# EAGLE design mouseHatbiggertest (EAGLE 9.6.2)
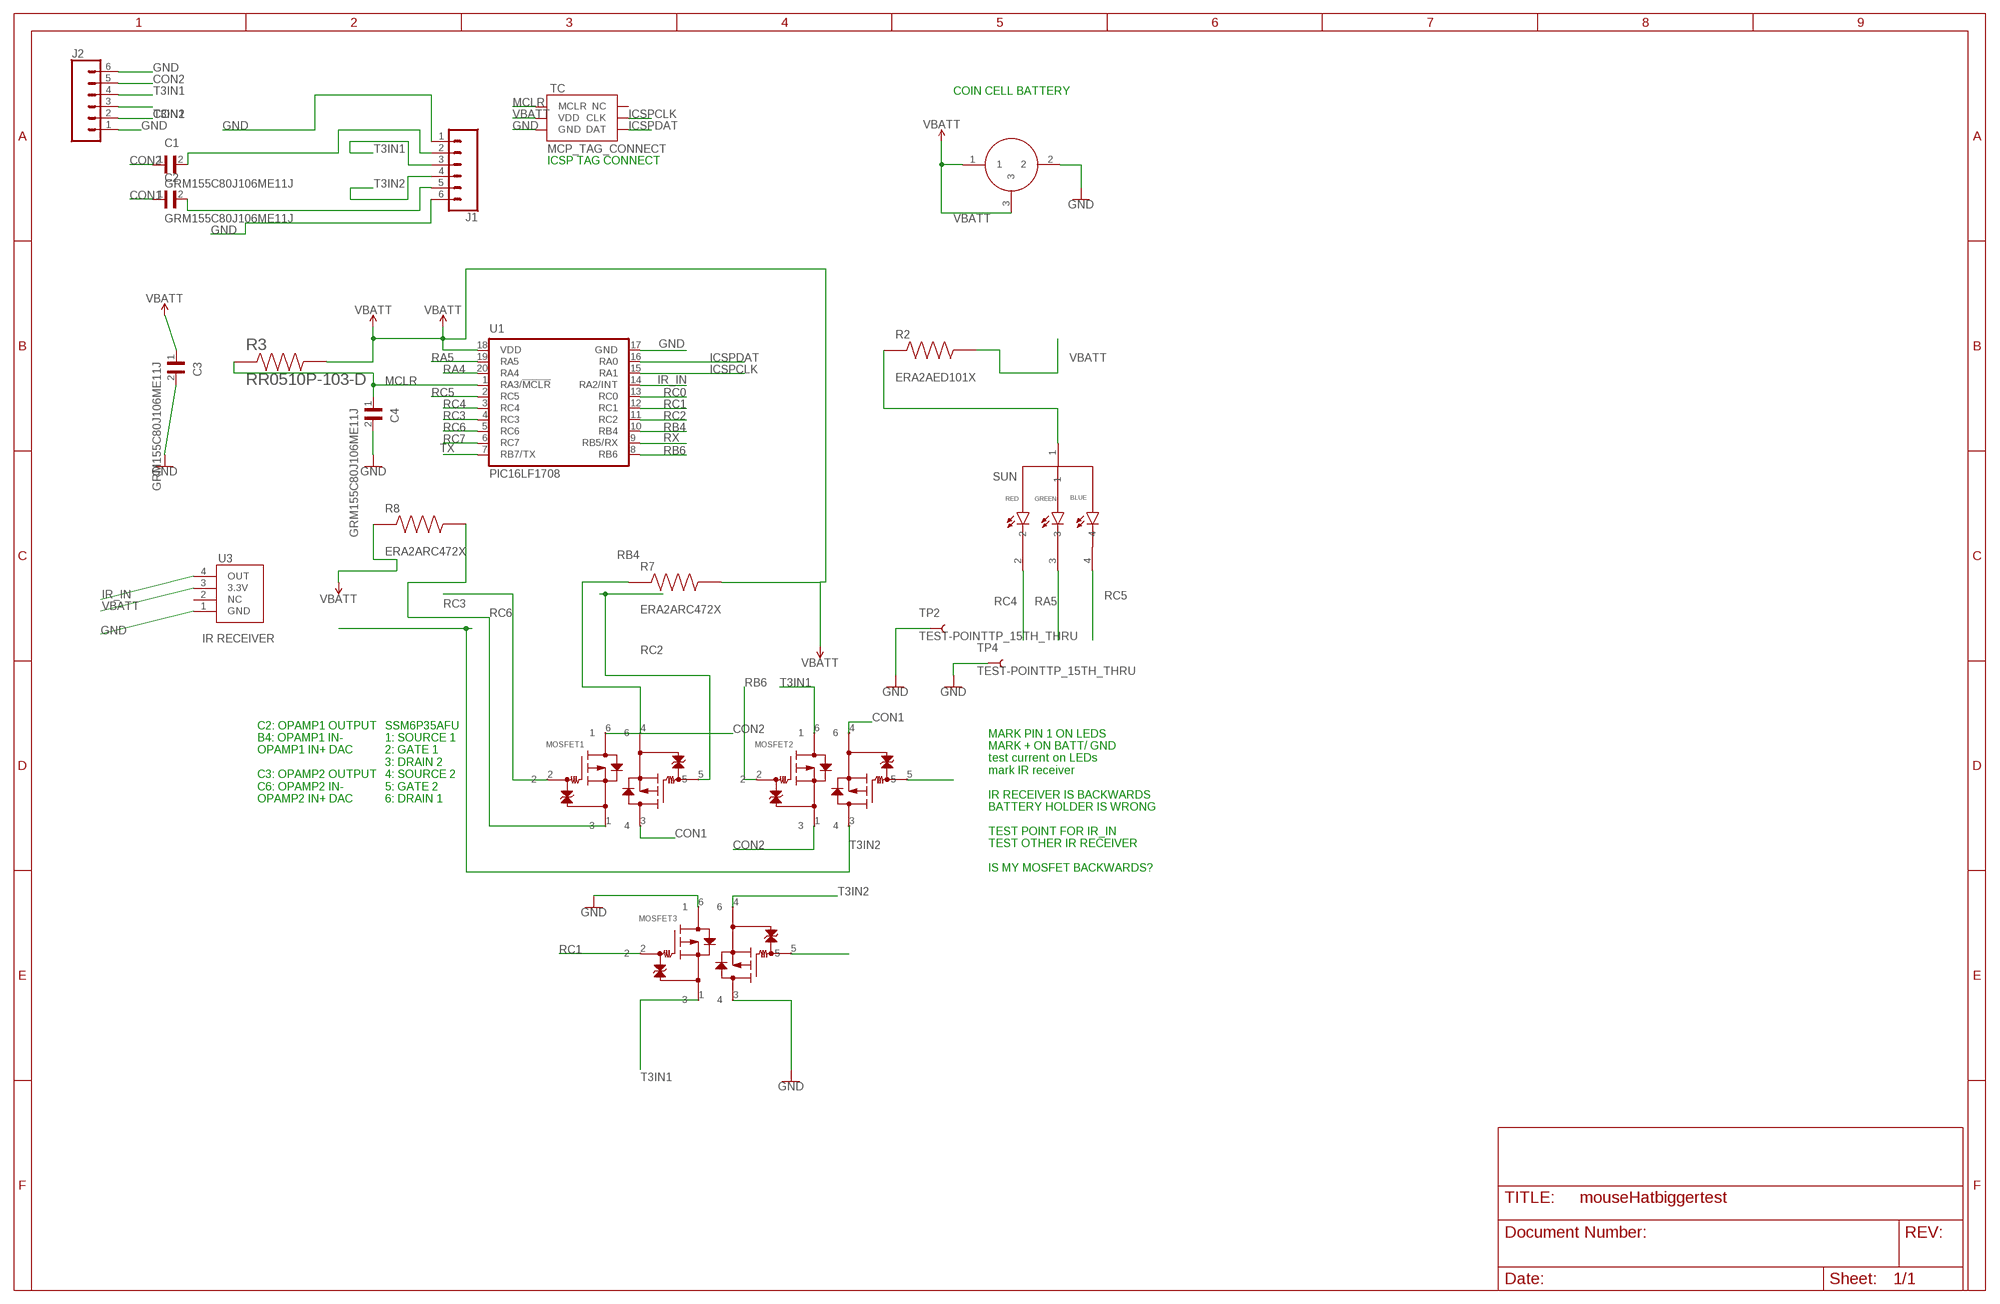
[diagram p0: schematic, sheet 1]

## Parts
C1  GRM155C80J106ME11J  [CAPC1005X70N]
C2  GRM155C80J106ME11J  [CAPC1005X70N]
C3  GRM155C80J106ME11J  [CAPC1005X70N]
C4  GRM155C80J106ME11J  [CAPC1005X70N]
J1  CONN_06NO_SILK_FEMALE_PTH  [1X06_NO_SILK]
J2  CONN_06NO_SILK_FEMALE_PTH  [1X06_NO_SILK]
MOSFET1  SSM6P35AFE,LF  [ES6_TOS]
MOSFET2  SSM6P35AFE,LF  [ES6_TOS]
MOSFET3  SSM6P35AFE,LF  [ES6_TOS]
R2  ERA2AED101X  [RES_ERA2AED101X]
R3  RR0510P-103-D  [RESC1005X40N]
R7  ERA2ARC472X  [RES_ERA2ARC472X]
R8  ERA2ARC472X  [RES_ERA2ARC472X]
TC  MCP_TAG_CONNECT  [TAG_CONNECT_MCP]
TP2  TEST-POINTTP_15TH_THRU  [TP_15TH]
TP4  TEST-POINTTP_15TH_THRU  [TP_15TH]
U1  PIC16LF1708  PIC16LF1708QFN20  [QFN20]
U3  IR RECEIVER  TSOP6238  [TSOP6238]
U$2  10MM_BATT_HOLDER  [10MM_BATT_HOLDER]
U$6  SUN  LED_RGB_SUN  [LED_RGB_SUN]

## Nets
CON1: C2.1 J2.2 MOSFET1.3 MOSFET2.4
CON2: C1.1 J2.5 MOSFET1.6 MOSFET2.1
GND: C3.2 C4.2 J1.1 J1.6 J2.1 J2.6 MOSFET3.3 MOSFET3.6 TC.3(GND) TP2.P$1 TP4.P$1 U1.17(GND) U3.1(GND) U$2.2
ICSPCLK: TC.5(CLK) U1.15(RA1)
ICSPDAT: TC.4(DAT) U1.16(RA0)
IR_IN: U1.14(RA2/INT) U3.4(OUT)
MCLR: C4.1 R3.1 TC.1(MCLR) U1.1(RA3/!MCLR)
N$2: C2.2 J1.5
N$3: R2.1 U$6.1
N$4: C1.2 J1.2
RA4: U1.20(RA4)
RA5: U1.19(RA5) U$6.3
RB4: MOSFET1.4 R7.1 U1.10(RB4)
RB6: MOSFET2.2 U1.8(RB6)
RC0: MOSFET2.5 U1.13(RC0)
RC1: MOSFET3.2 U1.12(RC1)
RC2: MOSFET1.5 U1.11(RC2)
RC3: MOSFET1.2 U1.4(RC3)
RC4: U1.3(RC4) U$6.2
RC5: U1.2(RC5) U$6.4
RC6: MOSFET1.1 R8.2 U1.5(RC6)
RC7: MOSFET3.5 U1.6(RC7)
RX: U1.9(RB5/RX)
T3IN1: J1.3 J2.4 MOSFET2.6 MOSFET3.1
T3IN2: J1.4 J2.3 MOSFET2.3 MOSFET3.4
TX: U1.7(RB7/TX)
VBATT: C3.1 R2.2 R3.2 R7.2 R8.1 TC.2(VDD) U1.18(VDD) U3.3(3.3V) U$2.1 U$2.3
Unconnected: TC.6(NC) U3.2(NC)

## Notes on the sheet
- COIN CELL BATTERY
- ICSP TAG CONNECT
- C2: OPAMP1 OUTPUT
  B4: OPAMP1 IN-
  OPAMP1 IN+ DAC
  
  C3: OPAMP2 OUTPUT
  C6: OPAMP2 IN-
  OPAMP2 IN+ DAC
- SSM6P35AFU
  1: SOURCE 1
  2: GATE 1
  3: DRAIN 2
  4: SOURCE 2
  5: GATE 2
  6: DRAIN 1
- MARK PIN 1 ON LEDS
  MARK + ON BATT/ GND
  test current on LEDs
  mark IR receiver
  
  IR RECEIVER IS BACKWARDS
  BATTERY HOLDER IS WRONG
  
  TEST POINT FOR IR_IN
  TEST OTHER IR RECEIVER
  
  IS MY MOSFET BACKWARDS?

## Library data of the parts
C1-C4 = GRM155C80J106ME11J:GRM155C80J106ME11J; DESCRIPTION: 10µF ±20% 6.3V Ceramic Capacitor X6S 0402 (1005 Metric); DIGI-KEY_PART_NUMBER: 490-18210-1-ND; MF: Murata Electronics; MP: GRM155C80J106ME11J; PACKAGE: 1005 Murata
J1 J2 = SparkFun-Connectors:CONN_06: Multi connection point. Often used as Generic Header-pin footprint for 0.1 inch spaced/style header connections On any of the 0.1 inch spaced packages, you can populate with these: Break Away Headers - Straight <https://www.sparkfun.com/products/116> (PRT-00116) Break Away Male Headers - Right Angle <https://www.sparkfun.com/products/553> (PRT-00553) Female Headers <https://www.sparkfun.com/products/115> (PRT-00115) Break Away Headers - Machine Pin <https://www.sparkfun.com/products/117> (PRT-00117) Break Away Female Headers - Swiss Machine Pin <https://www.sparkfun.com/products/743> (PRT-00743) Arduino Stackable Header - 6 Pin <https://www.sparkfun.com/products/9280> (PRT-09280) For SCREWTERMINALS and SPRING TERMINALS visit here: Screw Terimnals on SparkFun.com <https://www.sparkfun.com/search/results?term=Screw+Terminals> (5mm/3.5mm/2.54mm spacing) This device is also useful as a general connection point to wire up your design to another part of your project. Our various solder wires solder well into these plated through hole pads. Hook-Up Wire - Assortment (Stranded, 22 AWG) <https://www.sparkfun.com/products/11375> (PRT-11375) Hook-Up Wire - Assortment (Solid Core, 22 AWG) <https://www.sparkfun.com/products/11367> (PRT-11367) View the entire wire category on our website here <https://www.sparkfun.com/categories/141>; PROD_ID: CONN-08437
MOSFET1-MOSFET3 = smallTransistorPackage:SSM6P35AFE,LF; COPYRIGHT: Copyright (C) 2021 Ultra Librarian. All rights reserved.; DIGI-KEY_PART_NUMBER_1: SSM6P35AFELFTR-ND; DIGI-KEY_PART_NUMBER_2: SSM6P35AFELFCT-ND; DIGI-KEY_PART_NUMBER_3: SSM6P35AFELFDKR-ND; MANUFACTURER_PART_NUMBER: SSM6P35AFE,LF; MFR_NAME: Toshiba Electronic Devices & Storage Co.
R2 = ERA2AED101X:ERA2AED101X; DESCRIPTION: 100 Ohms ±0.5% 0.063W, 1/16W Chip Resistor 0402 (1005 Metric) Automotive AEC-Q200 Thin Film; DIGI-KEY_PART_NUMBER: P100DECT-ND; MF: Panasonic; MP: ERA2AED101X; PACKAGE: 1005-2 Panasonic
R3 = RR0510P-103-D:RR0510P-103-D: RES, THIN FILM, 10K, 0.5%, 0.063W, 0402, REEL; DESCRIPTION: 10 kOhms ±0.5% 0.063W, 1/16W Chip Resistor 0402 (1005 Metric) Thin Film; DIGI-KEY_PART_NUMBER: RR05P10.0KDCT-ND; MF: Susumu; MP: RR0510P-103-D; PACKAGE: 1005 Panasonic Electronic Components; PURCHASE-URL: https://pricing.snapeda.com/search/part/RR0510P-103-D/?ref=eda
R7 R8 = ERA2ARC472X:ERA2ARC472X; DESCRIPTION: 4.7 kOhms ±0.25% 0.063W, 1/16W Chip Resistor 0402 (1005 Metric) Automotive AEC-Q200 Thin Film; DIGI-KEY_PART_NUMBER: P4.7KCQCT-ND; MF: Panasonic; MP: ERA2ARC472X; PACKAGE: 1005-2 Panasonic
TC = SophiEaglev9:MCP_TAG_CONNECT
TP2 TP4 = SparkFun-Connectors:TEST-POINT: SparkFun Test Points Bare copper test points for troubleshooting or In-Circuit-Testing. These are used by our Production team for verifying production board runs using pogo-pins on test beds. SparkFun Products: SparkFun LSM9DS1 Breakout <https://www.sparkfun.com/products/13284> SparkFun PSOC <https://www.sparkfun.com/products/13714> SparkFun Load Cell Amplifier <https://www.sparkfun.com/products/13879>
U1 = SophiEaglev9:PIC16LF1708
U3 = SophiEaglev9:TSOP6238
U$2 = SophiEaglev9:10MM_BATT_HOLDER
U$6 = SophiEaglev9:LED_RGB_SUN

## Board
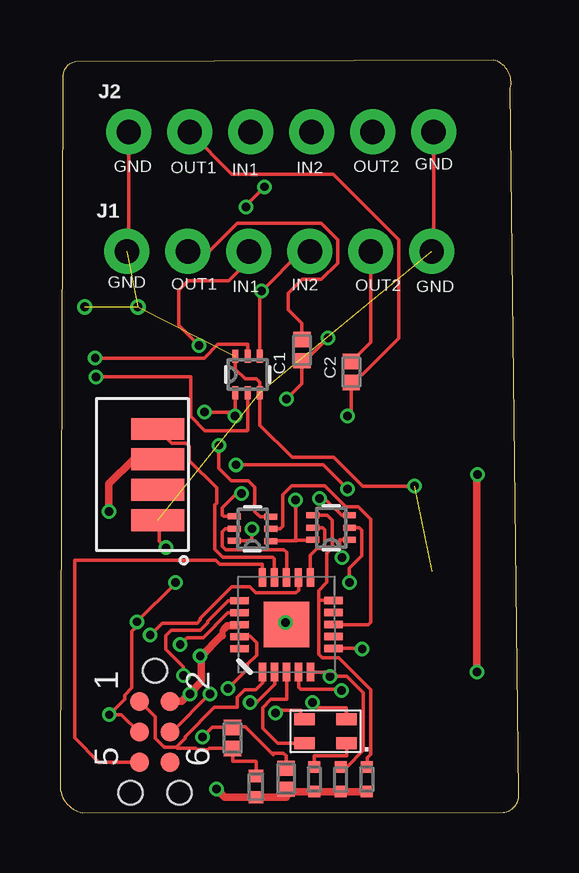
[diagram p1: board, top side]
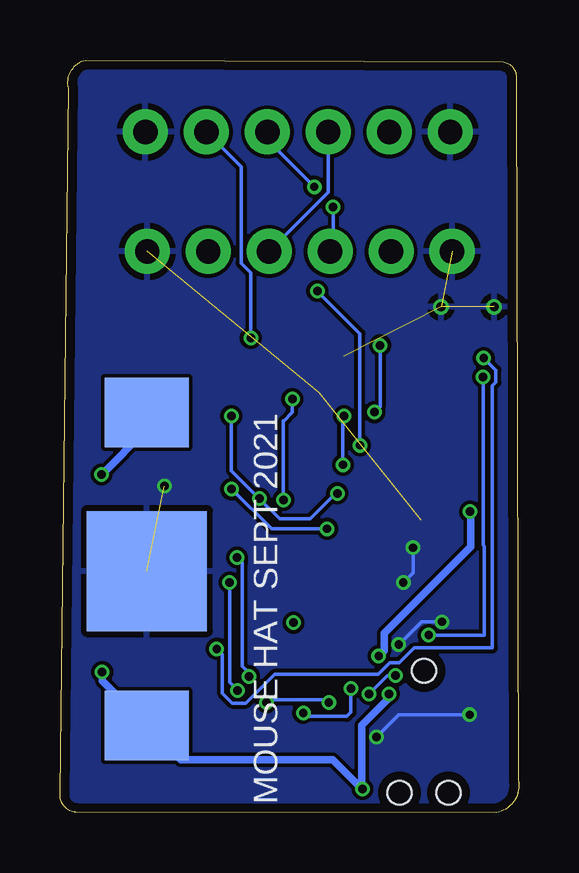
[diagram p2: board, bottom side, seen from below]

Size 19.12 x 31.37 mm. Coordinates in mm from the lower left corner, seen from the top.
Outline: 18.06,31.37 0.65,31.29 arc90 0.12,30.56 0.02,1.36 arc90 0.95,0 18.47,0.03 arc90 19.12,0.81 18.77,30.18 arc90 18.06,31.37
Copper layers (1*16): Top 0.035559375mm / dielectric 1.6mm / Bottom 0.035559375mm
Design rules "oshpark-2layer": minimum track width 6mil, minimum drill 10mil, track to track 6mil, track to pad 6mil, pad to pad 6mil, via to via 6mil, smd to smd 6mil, copper to edge 15mil, drill to drill 6mil, minimum pad ring 5mil, minimum via ring 5mil, stop-mask expansion 2.5mil, vias tented up to drill 0mil, thermal gap 10mil

### Footprints (pad centres in the part's own frame; a part is rotated, then mirrored left to right if it is on the bottom)
CAPC1005X70N = smd 0.64 x 0.72: 1 -0.439,0; 2 0.439,0
1X06_NO_SILK = drill 1.016 pad 1.88: 1 0,0; 2 2.54,0; 3 5.08,0; 4 7.62,0; 5 10.16,0; 6 12.7,0
ES6_TOS = smd 0.533 x 0.254: 1 -0.762,0.508; 2 -0.762,0; 3 -0.762,-0.508; 4 0.762,-0.508; 5 0.762,0; 6 0.762,0.508
RES_ERA2AED101X = smd 0.475 x 0.5: 1 -0.512,0; 2 0.512,0
RESC1005X40N = smd 0.51 x 0.6: 1 -0.445,0; 2 0.445,0
RES_ERA2ARC472X = smd 0.475 x 0.5: 1 -0.512,0; 2 0.512,0
TAG_CONNECT_MCP = smd 0.795 x 0.795: 1 -1.27,-0.635; 2 -1.27,0.635; 3 0,-0.635; 4 0,0.635; 5 1.27,-0.635; 6 1.27,0.635 | hole 0.998: -2.54,0; 2.54,1.016; 2.54,-1.016
TP_15TH = drill 0.381 pad 0.61: P$1 0,0
QFN20 = smd 0.762 x 0.3: 1 1.829,3.54; 2 1.829,3.04; 3 1.829,2.54; 4 1.829,2.04; 5 1.829,1.54; 11 5.766,1.54; 12 5.766,2.04; 13 5.766,2.54; 14 5.766,3.04; 15 5.766,3.54 | smd 0.3 x 0.762: 6 2.81,0.584; 7 3.31,0.584; 8 3.81,0.584; 9 4.31,0.584; 10 4.81,0.584; 16 4.81,4.496; 17 4.31,4.496; 18 3.81,4.496; 19 3.31,4.496; 20 2.81,4.496 | smd 1.905 x 1.905: P$1 3.81,2.54
TSOP6238 = smd 0.9 x 2.2: 1 -1.84,0.09; 2 -0.57,0.09; 3 0.7,0.09; 4 1.97,0.09
10MM_BATT_HOLDER = smd 2.9 x 3.5: 1 -6.6,0; 3 6.44,0 | smd 5 x 5: 2 0,0
LED_RGB_SUN = smd 0.85 x 0.5: 1 0.875,-0.5; 2 -0.875,-0.5; 3 -0.875,0.5; 4 0.875,0.5

### Placement (x,y rotation side)
C1  10.08,19.28 90 top
C2  12.14,18.36 90 top
C3  9.42,1.42 90 top
C4  7.18,3.12 90 top
J1  2.79,23.39 0 top
J2  2.86,28.37 0 top
MOSFET1  11.3,11.89 180 top
MOSFET2  8.02,11.84 179.6 top
MOSFET3  7.82,18.26 90 top
R2  10.59,1.4 270 top
R3  8.17,1.09 270 top
R7  12.77,1.4 270 top
R8  11.7,1.4 90 top
TC  3.96,3.38 270 top
TP2  1.04,21.08 0 top
TP4  3.25,21.08 0 top
U1  11.98,4.04 90.1 top
U3  4.16,14.03 90 top
U$2  15.5,10.08 270 bottom
U$6  11.06,3.4 0 top

### Tracks (layer width: path | path; a pad name or v marks a point on that pad's centre or on a via)
CON1  (via drill 0.35)
  Top 0.152: v10.82,13.1 11.03,13.1 11.73,12.4 MOSFET1.3 | MOSFET2.4 6.81,12.35 6.77,12.4 6.77,12.71 7.37,13.31 v7.57,13.31 | v11.98,16.54 12.14,16.69 C2.1 12.47,18.25 12.59,18.25 14.12,19.78 14.12,23.88 11.38,26.62 7.16,26.62 J2.2
  Bottom 0.152: v7.57,13.31 7.63,13.31 8.69,12.25 9.97,12.25 v10.82,13.1 11.98,14.26 v11.98,16.54
CON2  (via drill 0.35)
  Top 0.152: MOSFET2.1 9.85,11.33 9.82,11.35 | MOSFET1.6 10.51,11.35 9.82,11.35 | v9.82,13.04 9.82,11.36 9.82,11.35 | v9.44,17.25 10.08,17.88 10.08,18.72 | C1.1 10.08,18.72 | v11.17,19.79 10.1,18.72 10.08,18.72
  Bottom 0.152: v9.44,17.25 9.44,16.69 9.81,16.32 9.82,16.33 v9.82,13.04 | v11.17,19.79 11.17,22.5 11.58,22.91 11.58,26.92 J2.5
GND  (via drill 0.35)  (6 unrouted)
  Top 0.152: C4.2 7.21,3.59 7.71,3.59 8.82,2.48 | C4.2 7.16,3.59 | TC.3 3.32,3.33 2.56,4.09 v2.05,4.09 2.7,4.73 2.7,4.91 2.99,5.2 2.99,7.57 3.18,7.76 3.18,7.96 v3.21,7.96 | 9.42,1.88 C3.2 9.42,2.37 9.31,2.48 8.82,2.48 | U1.17 6.98,8.34 6.46,7.83 6.46,7.79 5.97,7.3 5.3,7.3 v5.01,7.01 | 3.2,12.19 U3.1 4.14,12.12 4.14,11.32 v4.41,11.05 | 8.82,2.48 8.88,2.42 | C4.2 6.35,3.56 v5.94,3.15 | v3.2,7.97 v3.21,7.96 | v3.21,7.96 4.82,9.58 v4.82,9.6 | v14.78,13.61 12.61,13.61 11.41,14.81 9.67,14.81 8.33,16.15 MOSFET3.3 8.33,17.93 8.17,18.08 7.72,18.08 7.31,18.49 MOSFET3.6 | J2.1 2.87,23.47 J1.1 | J2.6 15.57,23.47 J1.6
  Bottom 0.152: U$2.2 14.95,9.52 14.74,9.52 | v5.01,7.01 4.06,7.96 v3.21,7.96 | v4.82,9.6 4.41,10.01 v4.41,11.05 | v2.05,4.09 5,4.09 v5.94,3.15
  pour Bottom: 0.07,31.34 29.18,31.34 29.18,-0.03 0.07,-0.03
ICSPCLK
  Top 0.152: TC.5 1.62,2.11 0.61,3.13 0.61,10.52 6.49,10.52 6.66,10.36 8.43,10.36 8.43,10.35 U1.15
ICSPDAT  (via drill 0.35)
  Top 0.152: TC.4 4.67,3.38 v6.24,4.95 | U1.16 7.01,8.84 6.16,7.99 6.16,7.91 5.85,7.6 4.63,7.6 4.4,7.38 4.4,6.83 5.14,6.09 v5.14,5.72
  Bottom 0.152: v6.24,4.95 5.48,5.72 v5.14,5.72
IR_IN
  Top 0.152: U1.14 8.93,10.59 8.86,10.66 6.78,10.66 6.45,10.99 6.45,12.83 6.52,12.9 6.52,13.28 6.52,13.55 5.4,14.67 5.4,15.28 5.26,15.41 4.66,15.41 U3.4
MCLR
  Top 0.152: TC.1 3.97,4 3.97,3.12 4.33,2.75 | 4.34,2.74 4.33,2.75 | 4.34,2.74 4.35,2.75 4.33,2.75 | U1.1 8.44,5.42 8.15,5.14 7.71,5.14 7.39,4.83 7.39,4.39 6.43,4.39 5.22,3.18 5.22,3.12 4.9,2.8 4.9,2.69 | R3.1 8.17,2.13 8.15,2.16 7.21,2.16 7.21,2.66 C4.1 6.22,2.69 6.16,2.62 5.72,2.62 5.65,2.69 4.9,2.69 | 4.9,2.69 4.89,2.69 4.85,2.73 4.35,2.73 4.34,2.74
N$1  (via drill 0.35)
  other vias: 9.39,7.92
N$2
  Top 0.152: J1.5 12.95,19.62 C2.2
N$3
  Top 0.152: R2.1 10.59,2.37 11.96,2.37 11.96,2.88 U$6.1
N$4
  Top 0.152: C1.2 10.08,20.4 9.52,20.96 9.52,21.64 10.1,22.22 10.89,22.22 11.58,22.91 11.58,23.88 10.89,24.56 7.38,24.56 6.22,23.39 J1.2
RA5  (via drill 0.35)
  Top 0.152: U$6.3 10.03,4.05 10.03,4.27 9.09,4.27 v8.99,4.17 | U1.19 7.93,7.35 8.19,7.09 8.19,6.57 7.81,6.19 7.81,5.99 v7,5.18
  Bottom 0.152: v8.99,4.17 8.83,4.02 7.17,4.02 7,4.18 v7,5.18
RB4
  Top 0.152: 10.78,8.86 10.78,6.61 10.92,6.47 11.61,6.47 12.95,5.13 12.95,2.44 12.8,2.29 12.8,1.93 R7.1 | MOSFET1.4 11.13,12.4 11.34,12.18 11.34,11.03 11.12,10.82 11.12,9.6 10.78,9.26 10.78,8.86 | 10.78,8.86 10.79,8.85 U1.10
RB6
  Top 0.152: U1.8 12.84,7.84 12.94,7.94 12.94,12.23 12.42,12.75 11.91,12.75 11.04,13.63 9.65,13.63 9.28,13.26 9.28,11.94 9.17,11.83 MOSFET2.2
RC0
  Top 0.152: U1.13 9.44,10.85 9.32,10.96 6.91,10.96 6.76,11.11 6.76,11.71 6.9,11.84 MOSFET2.5
RC1  (via drill 0.35)
  Top 0.152: U1.12 9.94,9.28 9.83,9.17 8.16,9.17 7.9,9.43 7.16,9.43 5.85,8.12 5.85,8.04 5.72,7.91 4.26,7.91 v3.76,7.41 | v1.49,18.16 5.44,18.16 5.44,16.52 6.04,15.93 7.79,15.93 7.82,15.95 MOSFET3.2
  Bottom 0.152: v3.76,7.41 1.46,7.41 1.46,11.11 1.49,11.15 v1.49,18.16
RC2
  Top 0.152: U1.11 10.43,10.74 10.72,11.02 10.9,11.02 11.03,11.16 11.03,11.8 10.95,11.89 MOSFET1.5
RC3  (via drill 0.35)
  Top 0.152: U1.4 9.94,5.24 10.03,5.16 11.67,5.16 v11.73,5.1 | v12.06,9.6 12.06,10.2 12.57,10.71 12.57,11.79 12.47,11.89 MOSFET1.2
  Bottom 0.152: v11.73,5.1 11.72,5.11 12.06,5.44 v12.06,9.6
RC4
  Top 0.152: U$6.2 9.07,2.9 8.46,3.52 8.46,4.39 8.79,4.72 9.44,4.72 U1.3
RC5  (via drill 0.35)
  Top 0.152: U$6.4 11.94,4.38 10.72,4.38 10.67,4.43 10.67,4.45 v10.52,4.61 | U1.2 8.95,5.36 8.19,4.61 v7.93,4.61
  Bottom 0.152: v10.52,4.61 10.52,4.71 8.03,4.71 v7.93,4.61
RC6  (via drill 0.35)
  Top 0.152: U1.5 10.49,5.87 | 10.49,5.87 | 10.49,5.87 11.07,5.87 v11.25,5.69 11.96,5.69 12.64,5.01 12.64,2.61 11.94,1.91 R8.2 | v11.75,10.64 11.65,10.74 11.65,11.38 MOSFET1.1
  Bottom 0.152: v11.75,10.64 11.53,10.42 11.53,6.11 11.25,5.83 v11.25,5.69
RC7  (via drill 0.35)
  Top 0.152: U1.6 12.58,6.85 v12.59,6.83 | MOSFET3.5 7.82,19.52 6.58,19.52 6.01,18.95 v1.47,18.95
  Bottom 0.152: v12.59,6.83 12.36,6.6 12.36,4.98 11.95,4.57 11.38,4.57 10.18,5.77 5.86,5.77 5.38,6.25 4.98,6.25 4.35,6.87 1.11,6.87 1.11,17.79 0.96,17.94 0.96,18.44 v1.47,18.95
T3IN1  (via drill 0.35)
  Top 0.152: MOSFET2.6 7.92,11.33 8,11.4 v8,11.83 v7.99,11.84 | v7.34,14.5 10.97,14.5 v11.98,13.49 | J1.3 7.87,23.01 7.03,22.17 5.35,22.17 4.95,21.77 4.95,20.32 v5.79,19.48 | MOSFET3.1 7.31,16.56 v7.29,16.54 7.13,16.69 v6.02,16.69 | v8.53,26.09 7.74,25.3 v7.74,25.25
  Bottom 0.152: v11.98,13.49 11.96,13.49 10.31,11.84 v7.99,11.84 | v7.34,14.5 7.34,16.49 v7.29,16.54 | v5.79,19.48 5.79,16.93 v6.02,16.69 | J2.4 10.49,28.04 v8.53,26.09 | v7.74,25.25 7.74,23.52 J1.3
T3IN2  (via drill 0.35)
  Top 0.152: MOSFET2.3 8.35,12.34 8.27,12.42 8.25,12.42 8.12,12.55 8.12,13.56 7.84,13.85 7.14,13.85 6.62,14.36 v6.62,15.32 | J1.4 10.05,23.39 v8.4,21.74 8.33,21.67 MOSFET3.4
  Bottom 0.152: v6.62,15.32 6.62,19.96 v8.4,21.74 | J2.3 7.95,25.86 J1.4
VBATT  (via drill 0.35)
  Top 0.152: 5.89,6.53 v5.84,6.53
  Top 0.254: 6.86,7.69 6.77,7.59 6.77,7.37
  Top 0.305: R7.2 R8.1 R2.2 9.52,0.88 C3.1 9.42,0.65 R3.2 6.87,0.65 v6.52,0.99 | TC.2 5.08,4.65 5.39,4.96 v5.42,4.96 5.42,4.99 5.89,5.45 5.89,6.53 6.72,7.37 6.77,7.37 | v2.04,12.55 2.04,13.7 3.07,14.73 U3.3 | v17.37,5.87 17.37,14.07 v17.39,14.1 | U1.18 7.44,7.8 6.97,7.8 6.86,7.69
  Bottom 0.305: v5.42,4.96 5.42,4.78 6.55,3.66 6.55,1.02 v6.52,0.99 7.75,2.22 14.09,2.22 U$2.3 17.37,5.5 v17.37,5.87 | v5.84,6.53 5.62,6.76 5.62,7.49 2.01,11.09 2.01,12.52 v2.04,12.55 | v17.39,14.1 15.5,15.99 U$2.1

### Text on the board
tNames: GND | OUT1 | IN1 | IN2 | OUT2 | GND | GND | OUT1 | IN1 | IN2 | OUT2 | GND
bNames: MOUSE HAT SEPT 2021
tValues: No Caps | Caps